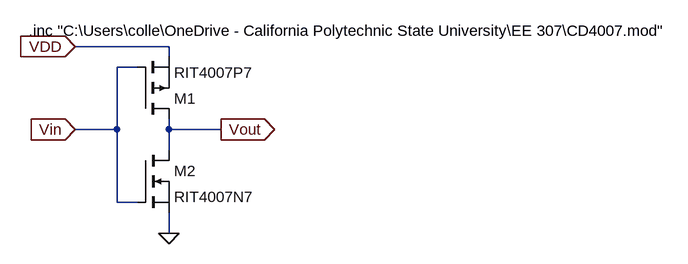
[diagram p0: schematic Inverter.asc]
Inverter.asc, the LTspice schematic file:
Version 4
SHEET 1 992 680
WIRE 176 16 32 16
WIRE 176 32 176 16
WIRE 128 48 96 48
WIRE 96 144 96 48
WIRE 96 144 32 144
WIRE 176 144 176 128
WIRE 256 144 176 144
WIRE 176 176 176 144
WIRE 96 256 96 144
WIRE 128 256 96 256
WIRE 176 304 176 272
FLAG 176 304 0
FLAG 32 144 Vin
IOPIN 32 144 In
FLAG 32 16 VDD
IOPIN 32 16 In
FLAG 256 144 Vout
IOPIN 256 144 Out
SYMBOL pmos 128 128 M180
SYMATTR InstName M1
SYMATTR Value RIT4007P7
SYMBOL nmos 128 176 R0
SYMATTR InstName M2
SYMATTR Value RIT4007N7
TEXT -40 -8 Left 2 !.inc "C:\\Users\\colle\\OneDrive - California Polytechnic State University\\EE 307\\CD4007.mod"

The netlist it stands for:
* Inverter.asc
M1 Vout Vin VDD VDD RIT4007P7
M2 Vout Vin 0 0 RIT4007N7
.model NMOS NMOS
.model PMOS PMOS
.lib standard.mos
.inc "C:\Users\colle\OneDrive - California Polytechnic State University\EE 307\CD4007.mod"
.backanno
.end